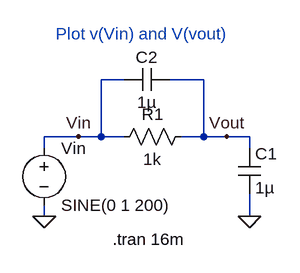
[diagram p0: schematic Fig1_22.asc]
Fig1_22.asc, the LTspice schematic file:
Version 4
SHEET 1 1048 680
WIRE 112 144 80 144
WIRE 224 144 176 144
WIRE 48 224 0 224
WIRE 80 224 80 144
WIRE 80 224 48 224
WIRE 112 224 80 224
WIRE 224 224 224 144
WIRE 224 224 192 224
WIRE 256 224 224 224
WIRE 288 224 256 224
WIRE 0 240 0 224
WIRE 288 240 288 224
WIRE 0 336 0 320
WIRE 288 336 288 304
FLAG 0 336 0
FLAG 288 336 0
FLAG 256 224 Vout
FLAG 48 224 Vin
SYMBOL voltage 0 224 R0
WINDOW 123 0 0 Left 0
WINDOW 39 0 0 Left 0
SYMATTR InstName Vin
SYMATTR Value SINE(0 1 200)
SYMBOL res 96 240 R270
WINDOW 0 32 56 VTop 0
WINDOW 3 0 56 VBottom 0
SYMATTR InstName R1
SYMATTR Value 1k
SYMBOL cap 272 240 R0
SYMATTR InstName C1
SYMATTR Value 1µ
SYMBOL cap 176 128 R90
WINDOW 0 0 32 VBottom 0
WINDOW 3 32 32 VTop 0
SYMATTR InstName C2
SYMATTR Value 1µ
TEXT 96 368 Left 0 !.tran 16m
TEXT 16 80 Left 0 ;Plot v(Vin) and V(vout)

The netlist it stands for:
* Fig1_22.asc
Vin Vin 0 SINE(0 1 200)
R1 Vin Vout 1k
C1 Vout 0 1µ
C2 Vout Vin 1µ
.tran 16m
* Plot v(Vin) and V(vout)
.backanno
.end